# Altium project 同步整流模块.PrjPcb
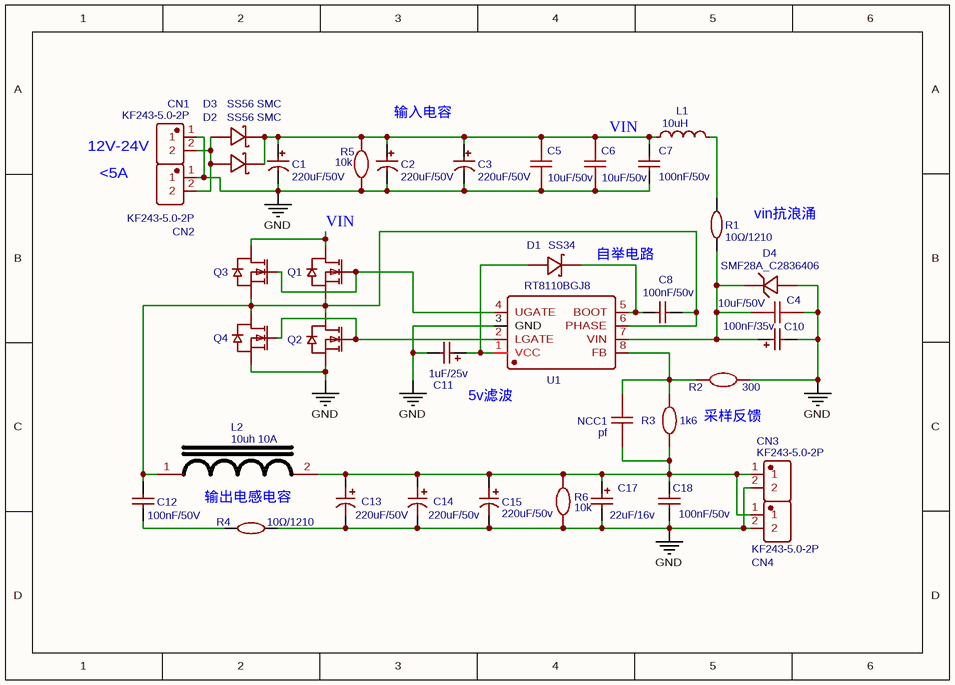
[diagram p0: SCH_V1.3.schdoc]
1 sheet, 38 parts. Net scope: global (net labels, ports and power ports of the same name join across sheets).
Board file: PCB_V1.4.pcbdoc

## Sheet SCH_V1.3.schdoc
size 177 x 127 mm; Author: KELEE; CompanyName: HIST; DrawnBy: KELEE; Engineer: KELEE; Revision: 1.0; Time: 2022-6

### Parts
C1  220uF/50V  [CAP-TH_BD10.0-P5.00-D1.0-FD]
C2  220uF/50V  [CAP-TH_BD10.0-P5.00-D1.0-FD]
C3  220uF/50V  [CAP-TH_BD10.0-P5.00-D1.0-FD]
C4  10uF/50V  [C1206]
C5  10uF/50v  [C1210]
C6  10uF/50v  [C1210]
C7  100nF/50v  [C1210]
C8  100nF/50v  [C1210]
C10  100nF/35v  [CAP-SMD_L3.2-W1.6]
C11  1uF/25v  [CAP-SMD_L3.2-W1.6-RD]
C12  100nF/50V  [C1210]
C13  220uF/50V  [CAP-TH_BD10.0-P5.00-D0.6-FD]
C14  220uF/50v  [CAP-TH_BD10.0-P5.00-D0.6-FD]
C15  220uF/50v  [CAP-TH_BD10.0-P5.00-D0.6-FD]
C17  22uF/16v  [CAP-SMD_L6.0-W3.2-R-RD]
C18  100nF/50v  [C1210]
CN1  KF243-5.0-2P  [CONN-TH_P5.00_KF243-5.0-2P]
CN2  KF243-5.0-2P  [CONN-TH_P5.00_KF243-5.0-2P]
CN3  KF243-5.0-2P  [CONN-TH_P5.00_KF243-5.0-2P]
CN4  KF243-5.0-2P  [CONN-TH_P5.00_KF243-5.0-2P]
D1  SS34  [DO-214AC_L4.3-W2.7-LS5.3-RD]
D2  SS56 SMC  [SMC_L7.1-W6.2-LS8.1-R-RD]
D3  SS56 SMC  [SMC_L7.1-W6.2-LS8.1-R-RD]
D4  SMF28A_C2836406  [SOD-123FL_L2.8-W1.8-LS3.8-RD]
L1  10uH  [L0805]
L2  10uh 10A  [L_R27cm_H11cm]
NCC1  pf  [C0603]
Q1  AOD442G-MS  [TO-252-3_L6.6-W6.1-P4.57-LS9.9-BR-CW]  (value not drawn)
Q2  AOD442G-MS  [TO-252-3_L6.6-W6.1-P4.57-LS9.9-BR-CW]  (value not drawn)
Q3  AOD442G-MS  [TO-252-3_L6.6-W6.1-P4.57-LS9.9-BR-CW]  (value not drawn)
Q4  AOD442G-MS  [TO-252-3_L6.6-W6.1-P4.57-LS9.9-BR-CW]  (value not drawn)
R1  10Ω/1210  [R1210]
R2  300  [R0603]
R3  1k6  [R0603]
R4  10Ω/1210  [R1210]
R5  10k  [R0805]
R6  10k  [R0805]
U1  RT8110BGJ8  [TSOT-23-8_L2.9-W1.6-P0.65-LS2.8-BR]

### Nets
GND: C1.2 C2.2 C3.2 C4.2 C5.1 C6.1 C7.1 C10.2 C11.2 C13.2 C14.2 C15.2 C17.2 C18.1 CN1.1 CN2.1 CN3.2 CN4.2 D4.2(A) Q2.3(S) Q4.3(S) R2.2 R4.2 R5.1 R6.1 U1.3(GND)
VIN: C1.1 C2.1 C3.1 C5.2 C6.2 C7.2 D2.2(K) D3.2(K) L1.2 Q1.2(D) Q3.2(D) R5.2
NetC4_1: C4.1 C10.1 D4.1(C) R1.1 U1.7(VIN)
NetC8_1: C8.1 D1.1(K) U1.5(BOOT)
NetC8_2: C8.2 C12.2 L2.1 Q1.3(S) Q2.2(D) Q3.3(S) Q4.2(D) U1.6(PHASE)
NetC11_1: C11.1 D1.2(A) U1.1(VCC)
NetC12_1: C12.1 R4.1
NetC13_1: C13.1 C14.1 C15.1 C17.1 C18.2 CN3.1 CN4.1 L2.2 NCC1.1 R3.1 R6.2
NetCN1_2: CN1.2 CN2.2 D2.1(A) D3.1(A)
NetL1_1: L1.1 R1.2
NetNCC1_2: NCC1.2 R2.1 R3.2 U1.8(FB)
NetQ1_1: Q1.1(G) Q3.1(G) U1.4(UGATE)
NetQ2_1: Q2.1(G) Q4.1(G) U1.2(LGATE)

### Notes on the sheet
- 12V-24V
- 输入电容
- <5A
- vin抗浪涌
- 自举电路
- 5v滤波
- 采样反馈
- 输出电感电容

### Library data of the parts
C1-C3 = 220uF/50V: BOM_Manufacturer: Rubycon; BOM_Manufacturer Part: 50YXA220MEFC10X12.5; nameAlias: Capacitance; Contributor: LCSC; BOM_Supplier: LCSC; BOM_Supplier Part: C338228; BOM_JLCPCB Part Class: Extended Part; spicePre: C; spiceSymbolName: 50YXA220MEFC10X12.5
C4 = 10uF/50V: BOM_Manufacturer: Murata Electronics; BOM_Manufacturer Part: GRM21BR61H106KE43L; nameAlias: Capacitance; Contributor: LCSC; BOM_Supplier: LCSC; BOM_Supplier Part: C440198; BOM_JLCPCB Part Class: Basic Part; spicePre: C; spiceSymbolName: GRM21BR61H106KE43L
C5 C6 = 10uF/50v: BOM_Manufacturer: Samsung Electro-Mechanics; BOM_Manufacturer Part: CL32B106KBJNNNE; nameAlias: Capacitance; Contributor: LCSC; BOM_Supplier: LCSC; BOM_Supplier Part: C138687; BOM_JLCPCB Part Class: Extended Part; spicePre: C; spiceSymbolName: CL32B106KBJNNNE
C7 C8 C18 = 100nF/50v: BOM_Manufacturer: FH; BOM_Manufacturer Part: 1210B104K500NT; nameAlias: Capacitance; BOM_Supplier: LCSC; BOM_Supplier Part: C76567; BOM_JLCPCB Part Class: Extended Part; spicePre: C; spiceSymbolName: 1210B104K500NT
C10 = 100nF/35v: BOM_Manufacturer: AVX; BOM_Manufacturer Part: TAJA104K035RNJ; nameAlias: Capacitance; BOM_Supplier: LCSC; BOM_Supplier Part: C7173; BOM_JLCPCB Part Class: Extended Part; spicePre: C; spiceSymbolName: TAJA104K035RNJ
C11 = 1uF/25v: BOM_Manufacturer: AVX; BOM_Manufacturer Part: TAJA105K025RNJ; nameAlias: Capacitance; BOM_Supplier: LCSC; BOM_Supplier Part: C7175; BOM_JLCPCB Part Class: Extended Part; spicePre: C; spiceSymbolName: TAJA105K025RNJ
C12 = 100nF/50V: BOM_Manufacturer: FH; BOM_Manufacturer Part: 1210B104K500NT; nameAlias: Capacitance; BOM_Supplier: LCSC; BOM_Supplier Part: C76567; BOM_JLCPCB Part Class: Extended Part; spicePre: C; spiceSymbolName: 1210B104K500NT
C13 = 220uF/50V: BOM_Manufacturer: 瑞隆; BOM_Manufacturer Part: 8221LFM1013H2RR00O; nameAlias: Capacitance; Contributor: LCSC; BOM_Supplier: LCSC; BOM_Supplier Part: C915761; BOM_JLCPCB Part Class: Extended Part; spicePre: C; spiceSymbolName: 8221LFM1013H2RR00O
C14 C15 = 220uF/50v: BOM_Manufacturer: 瑞隆; BOM_Manufacturer Part: 8221LFM1013H2RR00O; nameAlias: Capacitance; Contributor: LCSC; BOM_Supplier: LCSC; BOM_Supplier Part: C915761; BOM_JLCPCB Part Class: Extended Part; spicePre: C; spiceSymbolName: 8221LFM1013H2RR00O
C17 = 22uF/16v: BOM_Manufacturer: AVX; BOM_Manufacturer Part: TAJC226K016RNJ; nameAlias: Capacitance; BOM_Supplier: LCSC; BOM_Supplier Part: C11376; BOM_JLCPCB Part Class: Extended Part; spicePre: C; spiceSymbolName: TAJC226K016RNJ
CN1-CN4 = KF243-5.0-2P: BOM_Manufacturer: Cixi Kefa Elec; Contributor: LCSC; BOM_Supplier: LCSC; BOM_Supplier Part: C475222; BOM_Manufacturer Part: KF243-5.0-2P; BOM_JLCPCB Part Class: Extended Part; spicePre: C; spiceSymbolName: KF243-5.0-2P
D1 = SS34: BOM_Manufacturer: MDD; BOM_Supplier: LCSC; BOM_Manufacturer Part: SS34; BOM_Supplier Part: C8678; BOM_JLCPCB Part Class: Basic Part; spicePre: D; spiceSymbolName: SS34_C8678
D2 D3 = SS56 SMC: BOM_Manufacturer: MDD; BOM_Supplier: LCSC; BOM_Manufacturer Part: SS56 SMC; BOM_Supplier Part: C24138; BOM_JLCPCB Part Class: Extended Part; spicePre: D; spiceSymbolName: SS56 SMC
D4 = SMF28A_C2836406: BOM_Manufacturer: MSKSEMI(美森科); BOM_Manufacturer Part: SMF28A; Contributor: LCSC; BOM_Supplier: LCSC; BOM_Supplier Part: C2836406; BOM_JLCPCB Part Class: Extended Part; spicePre: D; spiceSymbolName: SMF28A_C2836406
L1 = 10uH: BOM_Manufacturer: microgate; BOM_Manufacturer Part: MGFL2012F100MT-LF; nameAlias: Inductance; Contributor: LCSC; BOM_Supplier: LCSC; BOM_Supplier Part: C281113; BOM_JLCPCB Part Class: Extended Part; spicePre: L; spiceSymbolName: MGFL2012F100MT-LF
L2 = 10uh 10A: Contributor: Guest; BOM_Supplier: LCSC; spicePre: L; spiceSymbolName: 10uh 10A
NCC1 = pf: nameAlias: Value(F); Contributor: LCEDA_Lib; spicePre: C; spiceSymbolName: C_0805_US
Q1-Q4 = AOD442G-MS: BOM_Manufacturer: MSKSEMI(美森科); Contributor: LCSC; BOM_Supplier: LCSC; BOM_Supplier Part: C2982213; BOM_Manufacturer Part: AOD442G-MS; link: https://atta.szlcsc.comnull; spicePre: Q; spiceSymbolName: AOD442G-MS
R1 R4 = 10Ω/1210: BOM_Manufacturer: UniOhm; BOM_Manufacturer Part: 1210W3F100JT5E; nameAlias: Resistance; Resistance (Ohms): 10; BOM_Supplier: LCSC; BOM_Supplier Part: C44451; BOM_JLCPCB Part Class: Extended Part; spicePre: R; spiceSymbolName: 1210W3F100JT5E
R2 R5 R6 = 300: nameAlias: Value(Ω); Contributor: LCEDA_Lib; spicePre: R; spiceSymbolName: R_0805_EU
R3 = 1k6: nameAlias: Value(Ω); Contributor: LCEDA_Lib; spicePre: R; spiceSymbolName: R_0805_EU
U1 = RT8110BGJ8: BOM_Manufacturer: RICHTEK; BOM_Supplier: LCSC; BOM_Manufacturer Part: RT8110BGJ8; BOM_Supplier Part: C27917; BOM_JLCPCB Part Class: Extended Part; spicePre: U; spiceSymbolName: RT8110BGJ8